# Altium schematic sheet IO.SchDoc
size A4
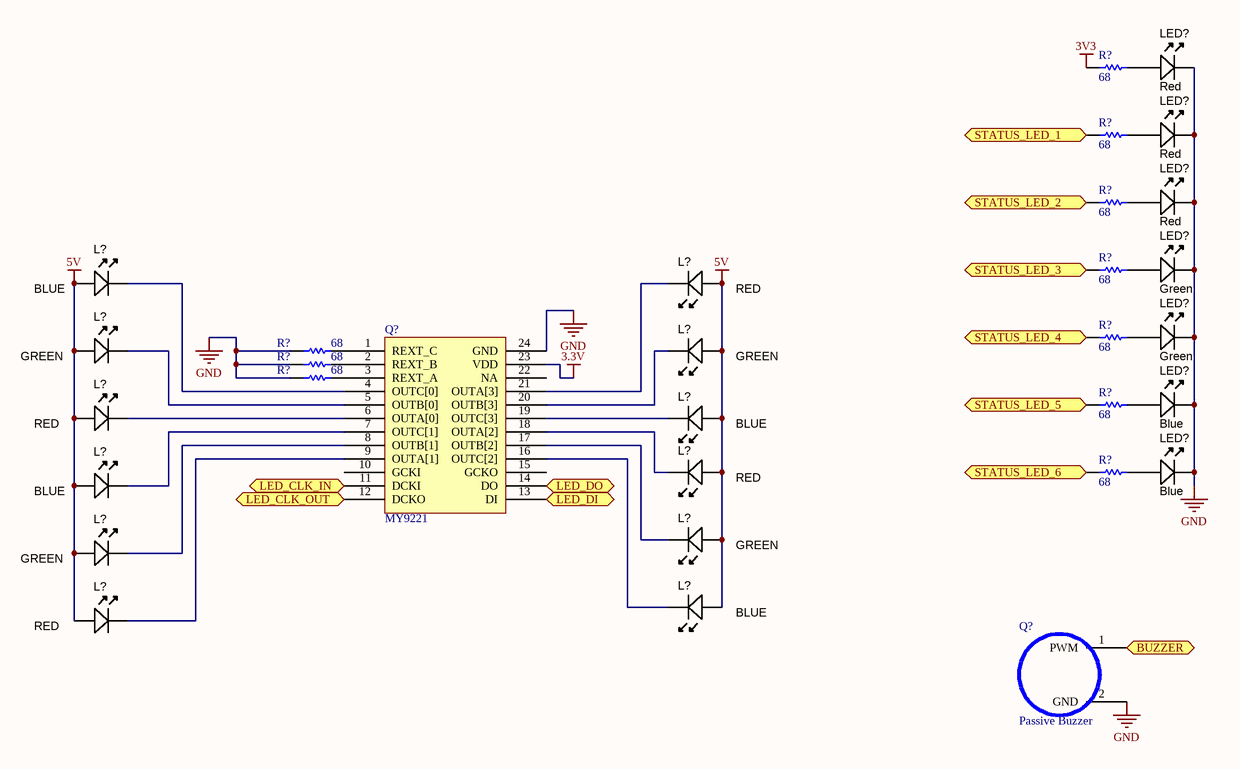
[diagram p0: IO.SchDoc]

## Parts
(Parts that share a designator on the sheet are numbered #1, #2 ... from top to bottom, then left to right.)
L?#1  Color: BLUE  [LED-0805-K]
L?#2  Color: RED  [LED-0805-K]
L?#3  Color: GREEN  [LED-0805-K]
L?#4  Color: GREEN  [LED-0805-K]
L?#5  Color: RED  [LED-0805-K]
L?#6  Color: BLUE  [LED-0805-K]
L?#7  Color: BLUE  [LED-0805-K]
L?#8  Color: BLUE  [LED-0805-K]
L?#9  Color: GREEN  [LED-0805-K]
L?#10  Color: GREEN  [LED-0805-K]
L?#11  Color: RED  [LED-0805-K]
L?#12  Color: RED  [LED-0805-K]
LED?#1  Color: Red  [LED-0805-K]
LED?#2  Color: Red  [LED-0805-K]
LED?#3  Color: Red  [LED-0805-K]
LED?#4  Color: Green  [LED-0805-K]
LED?#5  Color: Green  [LED-0805-K]
LED?#6  Color: Blue  [LED-0805-K]
LED?#7  Color: Blue  [LED-0805-K]
Q?#1  MY9221
Q?#2  Passive Buzzer  [Passive Buzzer]
R?#1  68  [6-0805]
R?#2  68  [6-0805]
R?#3  68  [6-0805]
R?#4  68  [6-0805]
R?#5  68  [6-0805]
R?#6  68  [6-0805]
R?#7  68  [6-0805]
R?#8  68  [6-0805]
R?#9  68  [6-0805]
R?#10  68  [6-0805]

## Ports
BUZZER (in), LED_CLK_IN (in), LED_CLK_OUT (out), LED_DI (in), LED_DO (out), STATUS_LED_1 (in), STATUS_LED_2 (in), STATUS_LED_3 (in), STATUS_LED_4 (in), STATUS_LED_5 (in), STATUS_LED_6 (in)

## Nets
3.3V: Q?#1.23(VDD)
3V3: R?#1.2
5V: L?#1.A L?#2.A L?#3.A L?#4.A L?#5.A L?#6.A L?#7.A L?#8.A L?#9.A L?#10.A L?#11.A L?#12.A
GND: LED?#1.K LED?#2.K LED?#3.K LED?#4.K LED?#5.K LED?#6.K LED?#7.K Q?#1.24(GND) Q?#2.2(GND) R?#6.2 R?#7.2 R?#8.2
BUZZER: Q?#2.1(PWM) ; port BUZZER
LED_CLK_IN: Q?#1.11(DCKI) ; port LED_CLK_IN
LED_CLK_OUT: Q?#1.12(DCKO) ; port LED_CLK_OUT
LED_DI: Q?#1.13(DI) ; port LED_DI
LED_DO: Q?#1.14(DO) ; port LED_DO
STATUS_LED_1: R?#2.2 ; port STATUS_LED_1
STATUS_LED_2: R?#3.2 ; port STATUS_LED_2
STATUS_LED_3: R?#4.2 ; port STATUS_LED_3
STATUS_LED_4: R?#5.2 ; port STATUS_LED_4
STATUS_LED_5: R?#9.2 ; port STATUS_LED_5
STATUS_LED_6: R?#10.2 ; port STATUS_LED_6
NetL?#1_K: L?#1.K Q?#1.4(OUTC[0])
NetL?#2_K: L?#2.K Q?#1.21(OUTA[3])
NetL?#3_K: L?#3.K Q?#1.5(OUTB[0])
NetL?#4_K: L?#4.K Q?#1.20(OUTB[3])
NetL?#5_K: L?#5.K Q?#1.6(OUTA[0])
NetL?#6_K: L?#6.K Q?#1.19(OUTC[3])
NetL?#7_K: L?#7.K Q?#1.18(OUTA[2])
NetL?#8_K: L?#8.K Q?#1.7(OUTC[1])
NetL?#9_K: L?#9.K Q?#1.17(OUTB[2])
NetL?#10_K: L?#10.K Q?#1.8(OUTB[1])
NetL?#11_K: L?#11.K Q?#1.16(OUTC[2])
NetL?#12_K: L?#12.K Q?#1.9(OUTA[1])
NetLED?#1_A: LED?#1.A R?#1.1
NetLED?#2_A: LED?#2.A R?#2.1
NetLED?#3_A: LED?#3.A R?#3.1
NetLED?#4_A: LED?#4.A R?#4.1
NetLED?#5_A: LED?#5.A R?#5.1
NetLED?#6_A: LED?#6.A R?#9.1
NetLED?#7_A: LED?#7.A R?#10.1
NetQ?#1_1: Q?#1.1(REXT_C) R?#6.1
NetQ?#1_2: Q?#1.2(REXT_B) R?#7.1
NetQ?#1_3: Q?#1.3(REXT_A) R?#8.1

Not connected (* = marked no-connect by the designer): Q?#1 10(GCKI) 15(GCKO) 22(NA)

## Library data of the parts
L?#1 L?#6-L?#8 = LED_SMD_Green_0805_6mcd: LED, 0805 SMD, Green; Manufacturer 1: LITE-ON; Manufacturer Part Number 1: LTST-C171GKT; Material: GaP; Ratings: 6 mcd; 569 nm; Value: BLUE; SCDType: source; Package / Case: 0805; Supplier 1: Digi-Key; Supplier Part Number 1: 160-1423-1-ND
L?#2 L?#5 L?#11 L?#12 = LED_SMD_Green_0805_6mcd: LED, 0805 SMD, Green; Manufacturer 1: LITE-ON; Manufacturer Part Number 1: LTST-C171GKT; Material: GaP; Ratings: 6 mcd; 569 nm; Value: RED; SCDType: source; Package / Case: 0805; Supplier 1: Digi-Key; Supplier Part Number 1: 160-1423-1-ND
L?#3 L?#4 L?#9 L?#10 LED?#4 LED?#5 = LED_SMD_Green_0805_6mcd: LED, 0805 SMD, Green; Manufacturer 1: LITE-ON; Manufacturer Part Number 1: LTST-C171GKT; Material: GaP; Ratings: 6 mcd; 569 nm; SCDType: source; Package / Case: 0805; Supplier 1: Digi-Key; Supplier Part Number 1: 160-1423-1-ND
  L?#3 L?#4 L?#9 L?#10: Value: GREEN
  LED?#4 LED?#5: Value: Green
LED?#1 = LED_SMD_Red_0805_6mcd: LED 0805 SMD Red 6mcd 621nm; Manufacturer 1: Lite-On Inc; Manufacturer Part Number 1: LTST-C171EKT; Material: GaAsP on GaP; Ratings: 6 mcd; 621 nm; SCDType: source; Package / Case: 0805; Supplier 1: Digi-Key; Supplier Part Number 1: 160-1422-1-ND; Value: Red
LED?#2 LED?#3 = LED_SMD_Green_0805_6mcd: LED, 0805 SMD, Green; Manufacturer 1: LITE-ON; Manufacturer Part Number 1: LTST-C171GKT; Material: GaP; Ratings: 6 mcd; 569 nm; Value: Red; SCDType: source; Package / Case: 0805; Supplier 1: Digi-Key; Supplier Part Number 1: 160-1423-1-ND
LED?#6 LED?#7 = LED_SMD_Green_0805_6mcd: LED, 0805 SMD, Green; Manufacturer 1: LITE-ON; Manufacturer Part Number 1: LTST-C171GKT; Material: GaP; Ratings: 6 mcd; 569 nm; Value: Blue; SCDType: source; Package / Case: 0805; Supplier 1: Digi-Key; Supplier Part Number 1: 160-1423-1-ND
Q?#1 = MY9221: Adaptive Pulse Density Modulation Control; PDF: http://www.seeedstudio.com/wiki/images/9/98/MY9221_DS_1.0.pdf
R?#1-R?#10 = ERJ6RB: Precision Thick Film Chip Resistor, 10 Ohm to 1M Ohm Range, 1% and 0.5% Tolerance, 0805 Size, 0.1 W; Published: 17-Dec-2003; LatestRevisionDate: 19-Mar-2004; LatestRevisionNote: Silkscreen size reduced.; PackageDocument: Mar-2003; PackageReference: 6-0805; Publisher: Altium Limited; Code_IPC: 2012 [0805]; ComponentLink1Description: Manufacturer Link; ComponentLink1URL: http://www.panasonic.com/industrial/components/resistive_products.htm; ComponentLink2Description: Datasheet; ComponentLink2URL: http://www.panasonic.com/industrial/components/pdf/AOA0000CE2.pdf
Q?#2 = Passive Buzzer: ALIX: http://www.aliexpress.com/item/General-passive-buzzer-magnetic-type-impedance-16-2khz-3v-5v-12v-general/1952004434.html